# EAGLE design pcb3 (EAGLE 9.7.0)
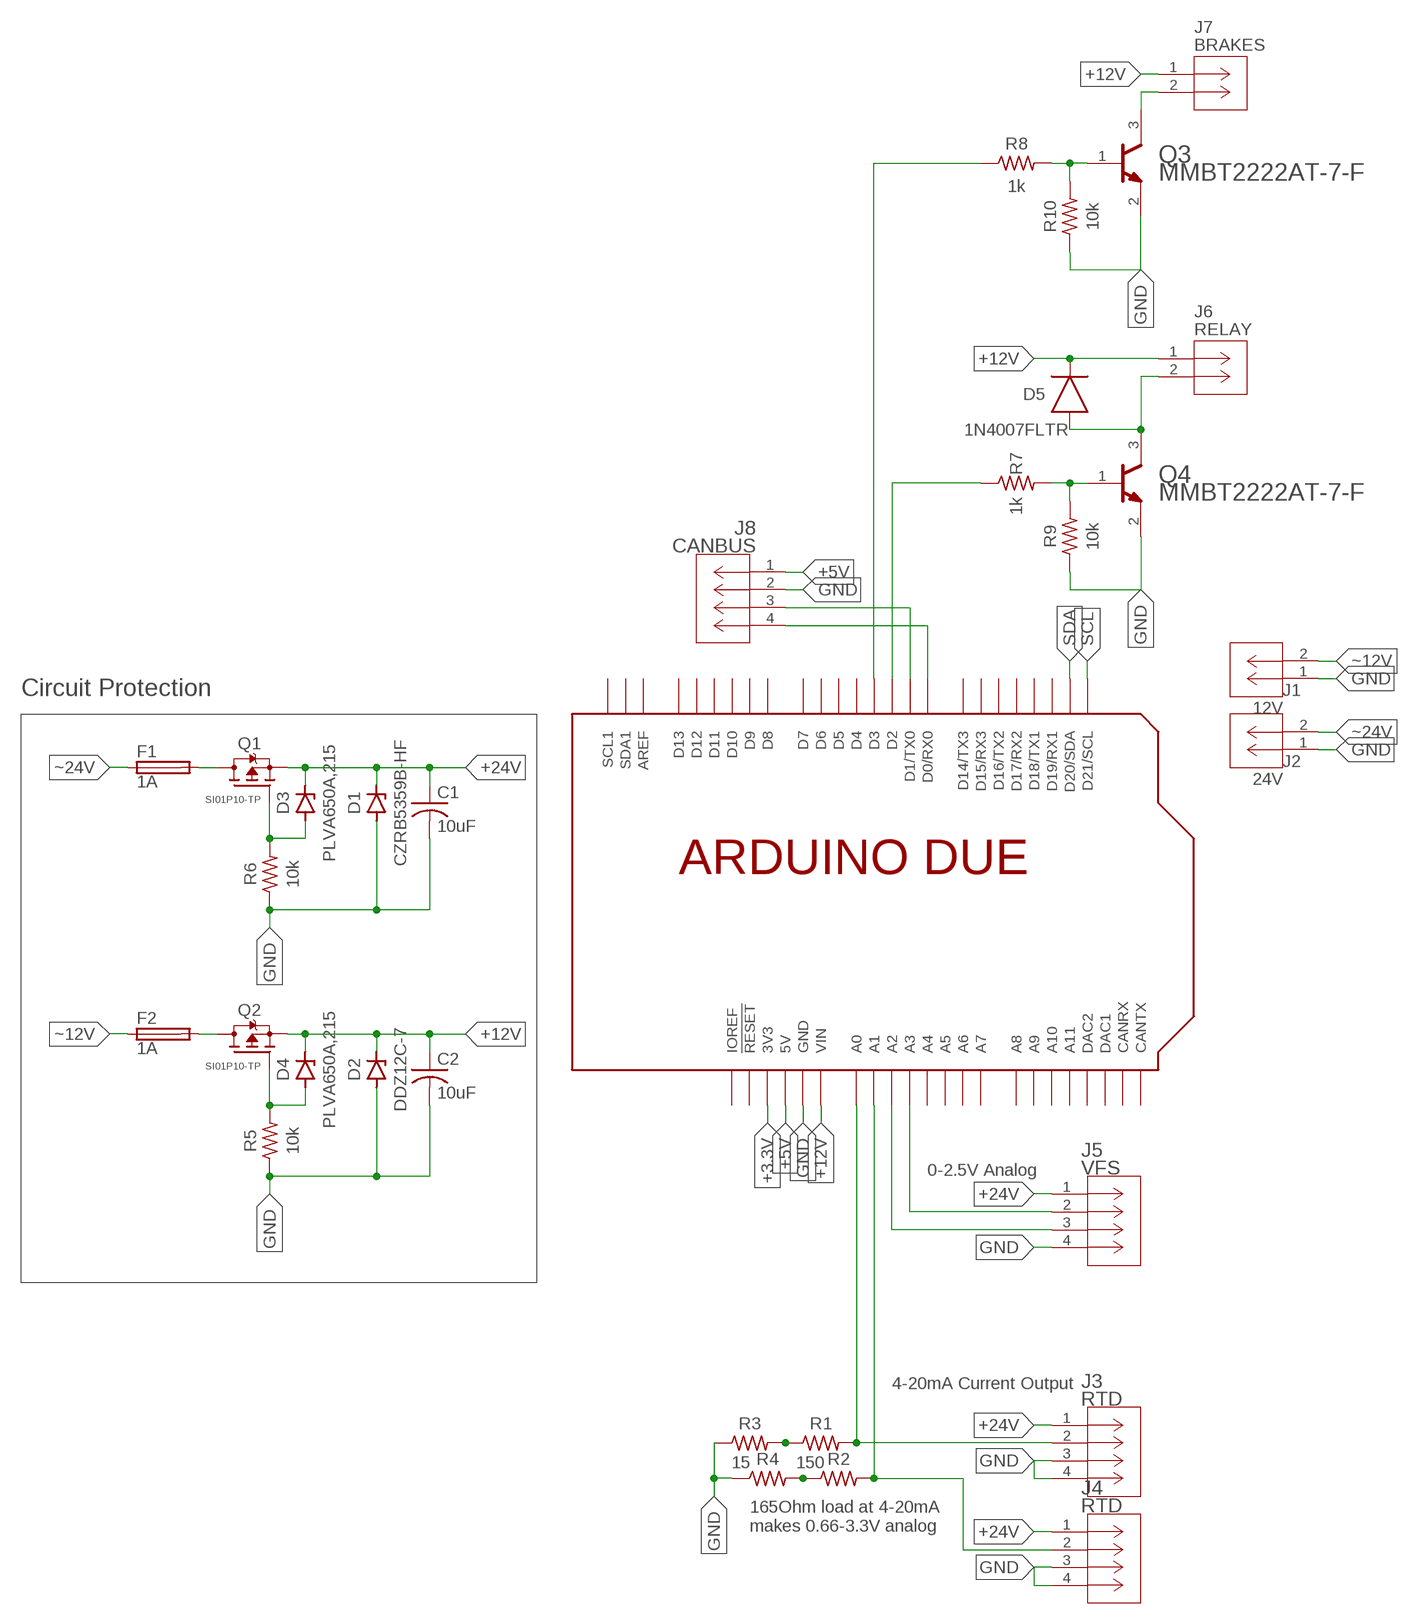
[diagram p0: schematic, sheet 1]

## Parts
C1  10uF  C-US_CHIP-1206(3216-METRIC)  [CAPC3216X135]
C2  10uF  C-US_CHIP-1206(3216-METRIC)  [CAPC3216X135]
D1  CZRB5359B-HF  ZENER_SMBJ5339BDO-214AA(SMB)  [DIOM5336X265N]
D2  DDZ12C-7  ZENER_MMSZ5240BTDO-219-AB(SOD123F)  [SODFL3718X115]
D3  PLVA650A,215  ZENER_SOT23  [SOT23]
D4  PLVA650A,215  ZENER_SOT23  [SOT23]
D5  1N4007FLTR  DIODE_SOD-123F  [SOD-123F]
F1  1A  FUSE_CHIP-0603(1608-METRIC)  [FUSC1608X60N]
F2  1A  FUSE_CHIP-0603(1608-METRIC)  [FUSC1608X60N]
J1  12V  5055670271CON_5055670271  [CON_5055670271]
J2  24V  5055670271CON_5055670271  [CON_5055670271]
J3  RTD  MICROLOCK-4PIN  [4PIN]
J4  RTD  MICROLOCK-4PIN  [4PIN]
J5  VFS  MICROLOCK-4PIN  [4PIN]
J6  RELAY  MICROLOCK-2PINCON_5055670271  [2PIN]
J7  BRAKES  MICROLOCK-2PINCON_5055670271  [2PIN]
J8  CANBUS  MICROLOCK-4PIN  [4PIN]
Q1  SI01P10-TP  PMOSFET_SOT23  [SOT23]
Q2  SI01P10-TP  PMOSFET_SOT23  [SOT23]
Q3  MMBT2222AT-7-F  NPN_SOT-523DIODES_INC_MMBT2222AT-7-F_0_0  [SOT-523]
Q4  MMBT2222AT-7-F  NPN_SOT-523DIODES_INC_MMBT2222AT-7-F_0_0  [SOT-523]
R1  150  R-US_CHIP-0603(1608-METRIC)  [RESC1608X60]
R2  150  R-US_CHIP-0603(1608-METRIC)  [RESC1608X60]
R3  15  R-US_CHIP-0603(1608-METRIC)  [RESC1608X60]
R4  15  R-US_CHIP-0603(1608-METRIC)  [RESC1608X60]
R5  10k  R-US_CHIP-0603(1608-METRIC)  [RESC1608X60]
R6  10k  R-US_CHIP-0603(1608-METRIC)  [RESC1608X60]
R7  1k  R-US_CHIP-0603(1608-METRIC)  [RESC1608X60]
R8  1k  R-US_CHIP-0603(1608-METRIC)  [RESC1608X60]
R9  10k  R-US_CHIP-0603(1608-METRIC)  [RESC1608X60]
R10  10k  R-US_CHIP-0603(1608-METRIC)  [RESC1608X60]
U$1  ARDUINODUE_MIN_NOHOLES  [ARDUINODUE_MIN_NOHOLES]

## Nets
+3.3V: U$1.3V3
+5V: J8.1 U$1.5V
+12V: C2.1 D2.1(C) D4.3(C) D5.C J6.1 J7.1 Q2.2(S) U$1.VIN
+24V: C1.1 D1.1(C) D3.3(C) J3.1 J4.1 J5.1 Q1.2(S)
GND: C1.2 C2.2 D1.2(A) D2.2(A) J1.1 J2.1 J3.3 J3.4 J4.3 J4.4 J5.4 J8.2 Q3.2(E) Q4.2(E) R3.1 R4.1 R5.1 R6.1 R9.1 R10.1 U$1.GND U$1.GND1(GND) U$1.GND2(GND)
N$1: J3.2 R1.2 U$1.A0
N$2: J4.2 R2.2 U$1.A1
N$3: J5.2 U$1.A3
N$4: J5.3 U$1.A2
N$5: J7.2 Q3.3(C)
N$6: R8.1 U$1.D3
N$7: D5.A J6.2 Q4.3(C)
N$8: R1.1 R3.2
N$9: D3.1(A) Q1.1(G) R6.2
N$10: R2.1 R4.2
N$11: D4.1(A) Q2.1(G) R5.2
N$12: F2.2 Q2.3(D)
N$13: F1.2 Q1.3(D)
N$14: R7.1 U$1.D2
N$15: Q4.1(B) R7.2 R9.2
N$16: Q3.1(B) R8.2 R10.2
N$19: J8.3 U$1.D1(D1/TX0)
N$20: J8.4 U$1.D0(D0/RX0)
SCL: U$1.D21(D21/SCL)
SDA: U$1.D20(D20/SDA)
~12V: F2.1 J1.2
~24V: F1.1 J2.2
Unconnected: U$1.A4 U$1.A5 U$1.A6 U$1.A7 U$1.A8 U$1.A9 U$1.A10 U$1.A11 U$1.AREF U$1.CANRX U$1.CANTX U$1.D4 U$1.D5 U$1.D6 U$1.D7 U$1.D8 U$1.D9 U$1.D10 U$1.D11 U$1.D12 U$1.D13 U$1.D14(D14/TX3) U$1.D15(D15/RX3) U$1.D16(D16/TX2) U$1.D17(D17/RX2) U$1.D18(D18/TX1) U$1.D19(D19/RX1) U$1.DAC1 U$1.DAC2 U$1.IOREF U$1.RESET(!RESET) U$1.SCL1 U$1.SDA1

## Notes on the sheet
- Circuit Protection
- 0-2.5V Analog
- 4-20mA Current Output
- 165Ohm load at 4-20mA 
  makes 0.66-3.3V analog

## Library data of the parts
C1 C2 = Capacitor:C-US: Capacitor - ANSI; CATEGORY: Capacitor
D1 = Diode:ZENER_: Zener Diode - Popular parts; CATEGORY: Diode; DESCRIPTION: DIODE ZENER 5.6V 5W DO214AA; MANUFACTURER: Micro Commercial Co; MPN: SMBJ5339B-TP; SUB-CATEGORY: Zener; THERMALLOSS: 5W; VALUE: SMBJ5339B
D2 = Diode:ZENER_: Zener Diode - Popular parts; CATEGORY: Diode; DESCRIPTION: DIODE ZENER 10V 500MW SOD123; MANUFACTURER: ON Semiconductor; MPN: MMSZ5240BT1G; SUB-CATEGORY: Zener; THERMALLOSS: 0.5W; VALUE: MMSZ5240BT1G
D3 D4 = Zener SOT23:ZENER_SOT23
D5 = Diode SOT-123FL:DIODE_SOD-123F
F1 F2 = Circuit-Protection:FUSE: Fuse - Generic; CATEGORY: Circuit-Protection; SUB-CATEGORY: Fuse
J1 J2 = Molex Micro-Lock PLUS (2-pin):5055670271; COPYRIGHT: Copyright (C) 2022 Ultra Librarian. All rights reserved.; MANUFACTURER_PART_NUMBER: 5055670271; MFR_NAME: Molex Connector Corporation
J3-J5 J8 = Molex Micro-Lock PLUS:MICROLOCK-4PIN
J6 J7 = Molex Micro-Lock PLUS:MICROLOCK-2PIN; COPYRIGHT: Copyright (C) 2022 Ultra Librarian. All rights reserved.; MANUFACTURER_PART_NUMBER: 5055670271; MFR_NAME: Molex Connector Corporation
Q1 Q2 = MOSFET SOT23:PMOSFET_SOT23
Q3 Q4 = NPN SOT-523:NPN_SOT-523: Bipolar (BJT) Transistor NPN 40V 600mA 300MHz 150mW Surface Mount SOT-523; AUTOMOTIVE: Yes; AUTOMOTIVE_GRADE: Grade 0; CENTROID_NOT_SPECIFIED: No; COLLECTOR_BASE_VOLTAGE: 75V; COLLECTOR_EMITTER_BREAKDOWN_VOLTAGE: 40V; COLLECTOR_EMITTER_SATURATION_VOLTAGE: 0.3V; COLLECTOR_EMITTER_VOLTAGE: 40V; DATASHEET: https://www.diodes.com/assets/Datasheets/ds30268.pdf; DELAY_TIME_TD: 10ns; DEVICE_CLASS_L1: Discrete Semiconductors; DEVICE_CLASS_L2: Transistors; DEVICE_CLASS_L3: BJTs; DIGIKEY_DESCRIPTION: TRANS NPN 40V 0.6A SOT523; DIGIKEY_PART_NUMBER: MMBT2222AT-FDICT-ND; EMITTER_BASE_VOLTAGE: 6V; FALL_TIME_TF: 60ns; FOOTPRINT_PARAMETERS_1: {"fp_type":"SOT523","params":{"N":{"long name":"Number of leads","type":"fixed","short name":"N","value":3},"A":{"nom":800000,"long name":"Height","min":600000,"max":900000,"short name":"A","type":"measurement"},"A1":{"nom":50000,"long name":"Standoff height","min":0,"max":100000,"short name":"A1","type":"measurement"},"A2":{"nom":750000,"long name":"Package height","min":600000,"max":800000,"short name":"A2","type":"measurement"},"E":{"nom":1600000,"long name":"Width /w leads","min":1450000,"max":1750000,"short name":"E","type":"measurement"},"E1":{"nom":800000,"long name":"Package width","min":750000,"max":850000,"short name":"E1","type":"measurement"},"D":{"nom":1600000,"long name":"Package length","min":1500000,"max":1700000,"short name":"D","type":"measurement"},"B":{"nom":220000,"long name":"Lead width","min":150000,"max":300000,"short name":"B","type":"measurement"},"B2":{"nom":220000,"long name":"Thermal lead width","min":150000,"max":300000,"short name":"B2","type":"measurement"},"C":{"nom":120000,"long name":"Lead thickness","min":100000,"max":200000,"short name":"C","type":"measurement"},"L":{"nom":330000,"long name":"Lead foot length","min":200000,"max":400000,"short name":"L","type":"measurement"},"e":{"nom":500000,"long name":"Lead pitch","min":null,"max":null,"short name":"e","type":"measurement"},"PHI":{"nom":8000000,"long name":"Lead angle","min":0,"max":false,"short name":"PHI","type":"measurement"},"offset x":{"nom":0,"long name":"X Center offset","min":null,"max":null,"short name":"offset x","type":"measurement"},"offset y":{"nom":0,"long name":"Y Center offset","min":null,"max":null,"short name":"offset y","type":"measurement"},"LS":{"default":"Rounded rectangle","long name":"Land shape","type":"multichoice","short name":"LS"},"LS1":{"default":"Rectangle","long name":"Land shape (Pin 1)","type":"multichoice","short name":"LS1"},"solder toe":{"nom":550000,"long name":"Solder fillet (toe)","min":null,"max":null,"short name":"solder toe","type":"fixedmeasurement"},"solder heel":{"nom":450000,"long name":"Solder fillet (heel)","min":null,"max":null,"short name":"solder heel","type":"fixedmeasurement"},"solder side":{"nom":50000,"long name":"Solder fillet (side)","min":null,"max":null,"short name":"solder side","type":"fixedmeasurement"},"courtyard":{"nom":500000,"long name":"Courtyard","min":null,"max":null,"short name":"courtyard","type":"fixedmeasurement"},"SF":{"default":"A","long name":"Packing level","type":"multichoiceparent","short name":"SF","help":"http://support.upverter.com/customer/portal/articles/978783-what-is-a-footprint-packing-level","children":["solder toe","solder heel","solder side","courtyard"]}}}; FOOTPRINT_PARAMETERS_2: {"fp_type":"SOT523","params":{"N":{"long name":"Number of leads","type":"fixed","short name":"N","value":3},"A":{"nom":800000,"long name":"Height","min":600000,"max":900000,"short name":"A","type":"measurement"},"A1":{"nom":50000,"long name":"Standoff height","min":0,"max":100000,"short name":"A1","type":"measurement"},"A2":{"nom":750000,"long name":"Package height","min":600000,"max":800000,"short name":"A2","type":"measurement"},"E":{"nom":1600000,"long name":"Width /w leads","min":1450000,"max":1750000,"short name":"E","type":"measurement"},"E1":{"nom":800000,"long name":"Package width","min":750000,"max":850000,"short name":"E1","type":"measurement"},"D":{"nom":1600000,"long name":"Package length","min":1500000,"max":1700000,"short name":"D","type":"measurement"},"B":{"nom":220000,"long name":"Lead width","min":150000,"max":300000,"short name":"B","type":"measurement"},"B2":{"nom":220000,"long name":"Thermal lead width","min":150000,"max":300000,"short name":"B2","type":"measurement"},"C":{"nom":120000,"long name":"Lead thickness","min":100000,"max":200000,"short name":"C","type":"measurement"},"L":{"nom":330000,"long name":"Lead foot length","min":200000,"max":400000,"short name":"L","type":"measurement"},"e":{"nom":500000,"long name":"Lead pitch","min":null,"max":null,"short name":"e","type":"measurement"},"PHI":{"nom":8000000,"long name":"Lead angle","min":0,"max":false,"short name":"PHI","type":"measurement"},"offset x":{"nom":0,"long name":"X Center offset","min":null,"max":null,"short name":"offset x","type":"measurement"},"offset y":{"nom":0,"long name":"Y Center offset","min":null,"max":null,"short name":"offset y","type":"measurement"},"LS":{"default":"Rounded rectangle","long name":"Land shape","type":"multichoice","short name":"LS"},"LS1":{"default":"Rectangle","long name":"Land shape (Pin 1)","type":"multichoice","short name":"LS1"},"solder toe":{"nom":350000,"long name":"Solder fillet (toe)","min":null,"max":null,"short name":"solder toe","type":"fixedmeasurement"},"solder heel":{"nom":350000,"long name":"Solder fillet (heel)","min":null,"max":null,"short name":"solder heel","type":"fixedmeasurement"},"solder side":{"nom":30000,"long name":"Solder fillet (side)","min":null,"max":null,"short name":"solder side","type":"fixedmeasurement"},"courtyard":{"nom":250000,"long name":"Courtyard","min":null,"max":null,"short name":"courtyard","type":"fixedmeasurement"},"SF":{"default":"B","long name":"Packing level","type":"multichoiceparent","short name":"SF","help":"http://support.upverter.com/customer/portal/articles/978783-what-is-a-footprint-packing-level","children":["solder toe","solder heel","solder side","courtyard"]}}}; FOOTPRINT_PARAMETERS_3: {"fp_type":"SOT523","params":{"N":{"long name":"Number of leads","type":"fixed","short name":"N","value":3},"A":{"nom":800000,"long name":"Height","min":600000,"max":900000,"short name":"A","type":"measurement"},"A1":{"nom":50000,"long name":"Standoff height","min":0,"max":100000,"short name":"A1","type":"measurement"},"A2":{"nom":750000,"long name":"Package height","min":600000,"max":800000,"short name":"A2","type":"measurement"},"E":{"nom":1600000,"long name":"Width /w leads","min":1450000,"max":1750000,"short name":"E","type":"measurement"},"E1":{"nom":800000,"long name":"Package width","min":750000,"max":850000,"short name":"E1","type":"measurement"},"D":{"nom":1600000,"long name":"Package length","min":1500000,"max":1700000,"short name":"D","type":"measurement"},"B":{"nom":220000,"long name":"Lead width","min":150000,"max":300000,"short name":"B","type":"measurement"},"B2":{"nom":220000,"long name":"Thermal lead width","min":150000,"max":300000,"short name":"B2","type":"measurement"},"C":{"nom":120000,"long name":"Lead thickness","min":100000,"max":200000,"short name":"C","type":"measurement"},"L":{"nom":330000,"long name":"Lead foot length","min":200000,"max":400000,"short name":"L","type":"measurement"},"e":{"nom":500000,"long name":"Lead pitch","min":null,"max":null,"short name":"e","type":"measurement"},"PHI":{"nom":8000000,"long name":"Lead angle","min":0,"max":false,"short name":"PHI","type":"measurement"},"offset x":{"nom":0,"long name":"X Center offset","min":null,"max":null,"short name":"offset x","type":"measurement"},"offset y":{"nom":0,"long name":"Y Center offset","min":null,"max":null,"short name":"offset y","type":"measurement"},"LS":{"default":"Rounded rectangle","long name":"Land shape","type":"multichoice","short name":"LS"},"LS1":{"default":"Rectangle","long name":"Land shape (Pin 1)","type":"multichoice","short name":"LS1"},"solder toe":{"nom":150000,"long name":"Solder fillet (toe)","min":null,"max":null,"short name":"solder toe","type":"fixedmeasurement"},"solder heel":{"nom":250000,"long name":"Solder fillet (heel)","min":null,"max":null,"short name":"solder heel","type":"fixedmeasurement"},"solder side":{"nom":10000,"long name":"Solder fillet (side)","min":null,"max":null,"short name":"solder side","type":"fixedmeasurement"},"courtyard":{"nom":100000,"long name":"Courtyard","min":null,"max":null,"short name":"courtyard","type":"fixedmeasurement"},"SF":{"default":"C","long name":"Packing level","type":"multichoiceparent","short name":"SF","help":"http://support.upverter.com/customer/portal/articles/978783-what-is-a-footprint-packing-level","children":["solder toe","solder heel","solder side","courtyard"]}}}; FOOTPRINT_URL: https://www.diodes.com/assets/Package-Files/SOT523.pdf; FOOTPRINT_VARIANT_NAME_0: Recommended_Land_Pattern; FOOTPRINT_VARIANT_NAME_1: IPC_A; FOOTPRINT_VARIANT_NAME_2: IPC_B; FOOTPRINT_VARIANT_NAME_3: IPC_C; GAIN_BANDWIDTH_PRODUCT: 300MHz; HEIGHT: 0.9mm; HFE_MAX: 300; HFE_MIN: 100; HFE_SS_MAX: 375; HFE_SS_MIN: 75; HFE_SS_TESTIC: 10mA; HFE_SS_TESTVCE: 10V; HFE_TESTIC: 150mA; HFE_TESTVCE: 10V; LEAD_FREE: Yes; MAX_COLLECTOR_CURRENT: 600mA; MAX_JUNCTION_TEMP: +150°C; MF: Diodes Inc; MFG_PACKAGE_IDENT: SOT523; MFG_PACKAGE_IDENT_COMPONENT_ID: b0b698c33057526b; MFG_PACKAGE_IDENT_DATE: 04/2018; MFG_PACKAGE_IDENT_REV: 0; MOUSER_DESCRIPTION: Bipolar Transistors - BJT 40V 150mW; MOUSER_PART_NUMBER: 621-MMBT2222AT-F; MPN: MMBT2222AT-7-F; NUMBER_OF_ELEMENTS: 1; NUMBER_OF_NPN: 1; PACKAGE: SOT-523; POWER_DISSIPATION: 150mW; PREFIX: Q; RISE_TIME_TR: 25ns; ROHS: Yes; RTHJA_MAX: 833°C/W; STANDOFF_HEIGHT: 0mm; STORAGE_TIME_TS: 225ns; TEMPERATURE_RANGE_HIGH: +150°C; TEMPERATURE_RANGE_LOW: -55°C; UNITY_GAIN_FREQ: 300MHz; VERIFICATION_VERSION: 0.0.0.3
R1-R10 = Resistor:R-US: Resistor Fixed - ANSI; CATEGORY: Resistor; SUB-CATEGORY: Fixed
U$1 = Arduino Shields:ARDUINODUE_MIN_NOHOLES

## Board
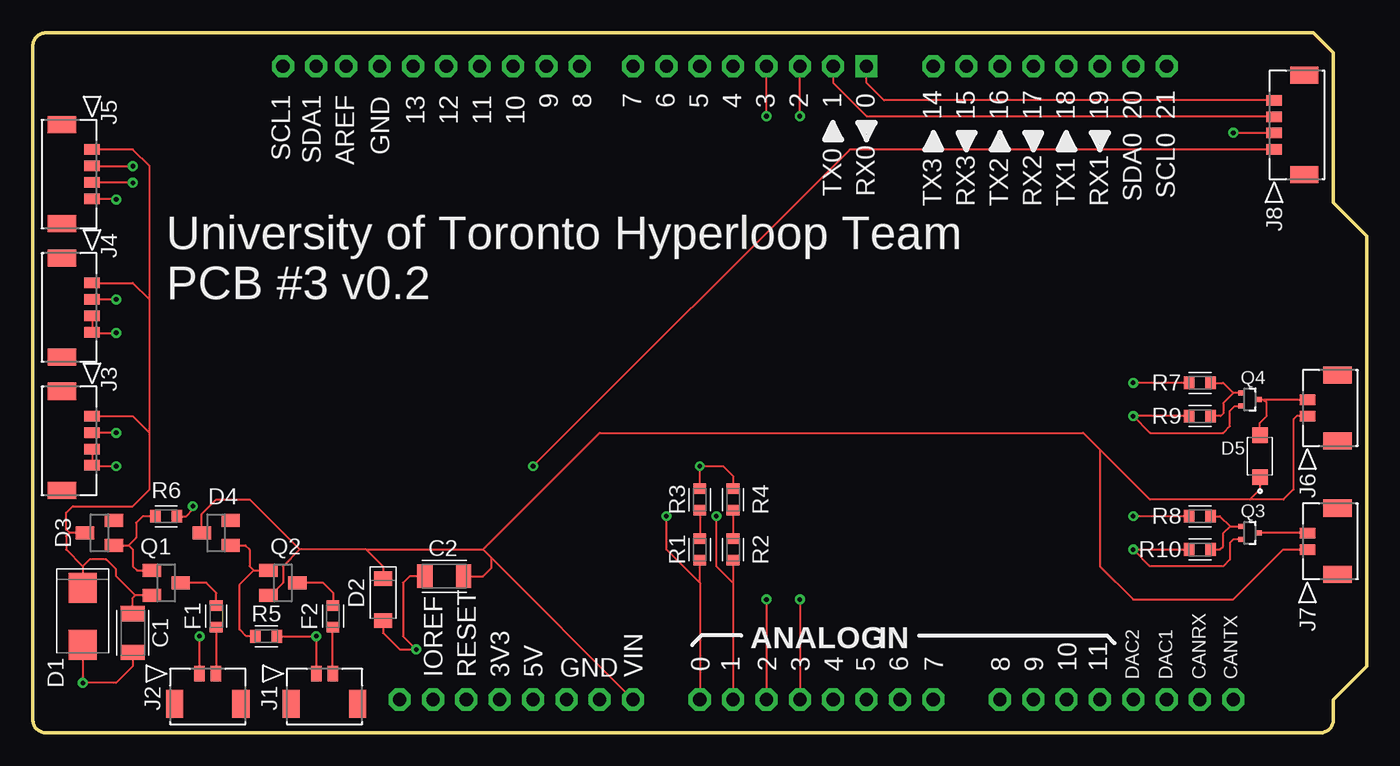
[diagram p1: board, top side]
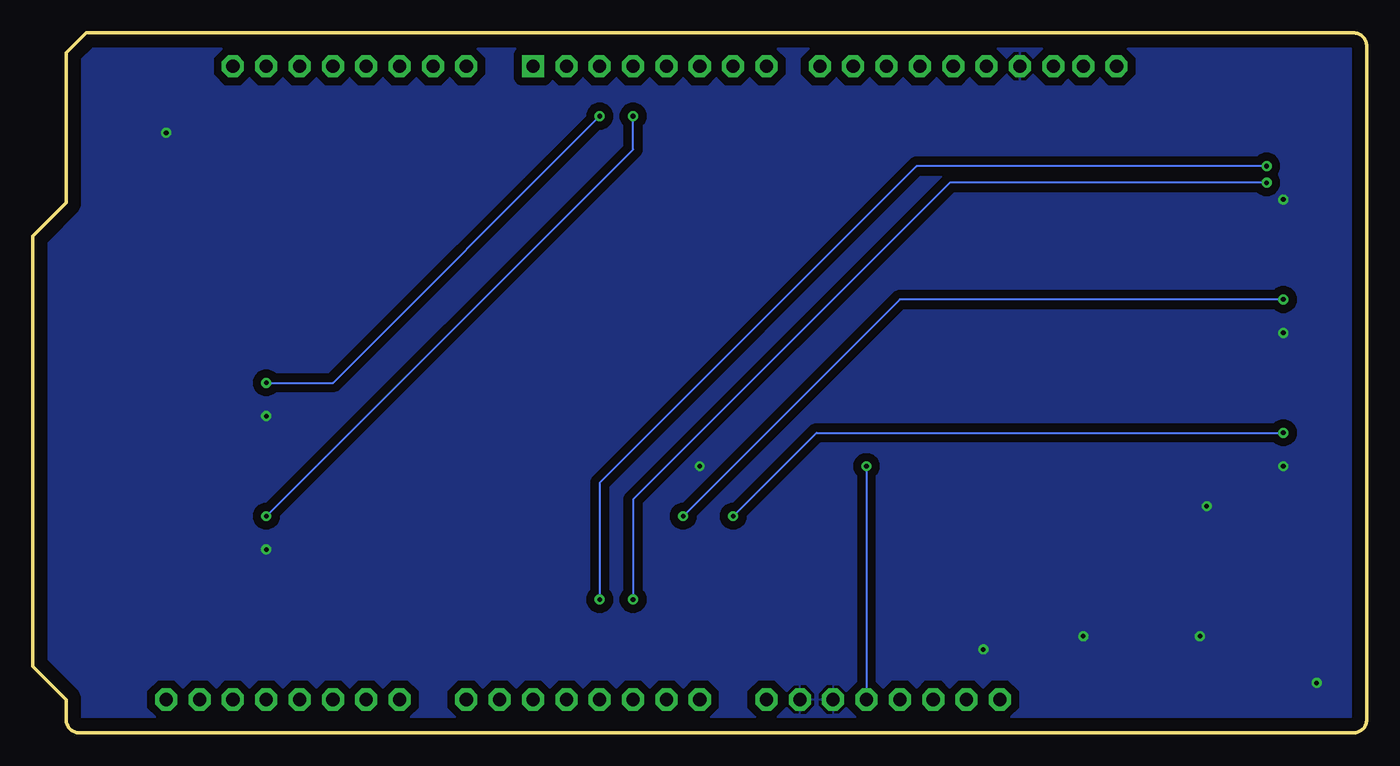
[diagram p2: board, bottom side, seen from below]

Size 101.6 x 53.34 mm. Coordinates in mm from the lower left corner, seen from the top.
Copper layers (1*16): Top 0.035mm / dielectric 1.5mm / Bottom 0.035mm
Design rules "default": minimum track width 6mil, minimum drill 0.35mm, track to track 6mil, track to pad 6mil, pad to pad 6mil, via to via 6mil, smd to smd 6mil, copper to edge 40mil, drill to drill 6mil, minimum pad ring 10mil, minimum via ring 8mil, stop-mask expansion 4mil, vias tented up to drill 0mil, thermal gap 10mil

### Footprints (pad centres in the part's own frame; a part is rotated, then mirrored left to right if it is on the bottom)
CAPC3216X135 = smd 1.165 x 1.815: 1 -1.475,0; 2 1.475,0
DIOM5336X265N = smd 2.284 x 2.124: 1 -2.164,0; 2 2.164,0
SODFL3718X115 = smd 1.115 x 1.361: 1 -1.6,0; 2 1.6,0
SOT23 = smd 1 x 1.4: 1 -0.95,-1.1; 2 0.95,-1.1; 3 0,1.1
SOD-123F = smd 1.18 x 1.17: A 1.59,0; C -1.59,0
FUSC1608X60N = smd 0.799 x 0.974: 1 -0.815,0; 2 0.815,0
CON_5055670271 = smd 0.8 x 1.2: 1 0,0; 2 -1.25,0 | smd 1.3 x 2.15: 3 1.9,2.295; 4 -3.15,2.295
4PIN = smd 0.8 x 1.2: 1 0,0; 2 -1.25,0; 3 -2.5,0; 4 -3.75,0 | smd 1.3 x 2.15: 5 1.9,2.295; 6 -5.65,2.295
2PIN = smd 0.8 x 1.2: 1 0,0; 2 -1.25,0 | smd 1.3 x 2.15: 3 1.9,2.295; 4 -3.15,2.295
SOT-523 = smd 0.51 x 0.4: 1 -0.645,0.5; 2 -0.645,-0.5; 3 0.645,0
RESC1608X60 = smd 0.799 x 0.974: 1 -0.815,0; 2 0.815,0
ARDUINODUE_MIN_NOHOLES = drill 1 pad 1.676 octagon: 3V3 35.56,2.54; 5V 38.1,2.54; A0 50.8,2.54; A1 53.34,2.54; A2 55.88,2.54; A3 58.42,2.54; A4 60.96,2.54; A5 63.5,2.54; A6 66.04,2.54; A7 68.58,2.54; A8 73.66,2.54; A9 76.2,2.54; A10 78.74,2.54; A11 81.28,2.54; AREF 23.876,50.8; CANRX 88.9,2.54; CANTX 91.44,2.54; D1 60.96,50.8; D2 58.42,50.8; D3 55.88,50.8; D4 53.34,50.8; D5 50.8,50.8; D6 48.26,50.8; D7 45.72,50.8; D8 41.656,50.8; D9 39.116,50.8; D10 36.576,50.8; D11 34.036,50.8; D12 31.496,50.8; D13 28.956,50.8; D14 68.58,50.8; D15 71.12,50.8; D16 73.66,50.8; D17 76.2,50.8; D18 78.74,50.8; D19 81.28,50.8; D20 83.82,50.8; D21 86.36,50.8; DAC1 86.36,2.54; DAC2 83.82,2.54; GND 26.416,50.8; GND1 43.18,2.54; GND2 40.64,2.54; IOREF 30.48,2.54; NC 27.94,2.54; RESET 33.02,2.54; SCL1 19.05,50.8; SDA1 21.59,50.8; VIN 45.72,2.54 | drill 1 pad 1.676 square: D0 63.5,50.8

### Placement (x,y rotation side)
C1  7.62,7.62 270 top
C2  31.34,11.94 180 top
D1  3.81,8.89 270 top
D2  26.67,10.16 270 top
D3  5.08,15.24 90 top
D4  13.97,15.24 90 top
D5  93.47,21.08 90 top
F1  13.97,8.89 90 top
F2  22.86,8.89 90 top
J1  21.59,4.51 180 top
J2  12.7,4.51 180 top
J3  4.51,24.13 90 top
J4  4.51,34.29 90 top
J5  4.51,44.45 90 top
J6  97.09,24.13 270 top
J7  97.09,13.97 270 top
J8  94.55,44.45 270 top
Q1  10.16,11.43 270 top
Q2  19.05,11.43 270 top
Q3  92.71,15.24 0 top
Q4  92.71,25.4 0 top
R1  50.8,13.97 270 top
R2  53.34,13.97 270 top
R3  50.8,17.78 270 top
R4  53.34,17.78 270 top
R5  17.78,7.37 180 top
R6  10.16,16.51 180 top
R7  88.9,26.67 0 top
R8  88.9,16.51 0 top
R9  88.9,24.13 0 top
R10  88.9,13.97 0 top
U$1  0,0 0 top

### Tracks (layer width: path | path; a pad name or v marks a point on that pad's centre or on a via)
+5V  (via drill 0.35)
  Top 0.152: J8.1 62.23,44.45 v38.1,20.32
  Bottom 0.152: v38.1,20.32 U$1.5V
+12V
  Top 0.152: Q2.2 18.1,10.48 19.05,11.43 19.05,12.7 20.32,13.97 | U$1.VIN 34.92,13.34 | 34.92,13.34 34.29,13.97 | 25.4,13.97 34.29,13.97 | 25.4,13.97 20.32,13.97 | D4.3 12.87,16.68 13.97,17.78 16.51,17.78 20.32,13.97 | D2.1 26.67,12.7 25.4,13.97 | 34.29,13.97 43.18,22.86 80.01,22.86 81.28,21.59 | 81.28,21.59 81.28,12.7 83.82,10.16 91.44,10.16 95.25,13.97 J7.1 | J6.1 96.27,24.13 96.01,23.88 96.01,18.54 95.25,17.78 92.71,17.78 | 92.71,17.78 85.09,17.78 81.28,21.59 | D5.C 93.47,18.54 92.71,17.78 | C2.1 34.29,11.94 34.92,12.57 34.92,13.34
+24V
  Top 0.152: D3.3 2.79,15.24 | 2.79,15.24 2.54,15.49 2.54,16.76 3.05,17.27 7.62,17.27 8.89,18.54 8.89,22.86 | 8.89,22.86 8.89,33.02 | 8.89,33.02 8.89,43.18 7.62,44.45 J5.1 | 2.79,15.24 2.54,14.99 2.54,13.97 3.81,12.7 | 3.81,12.7 D1.1 | Q1.2 7.81,10.48 | 7.81,10.48 6.35,11.94 6.35,12.45 5.59,13.21 4.32,13.21 3.81,12.7 | 7.81,10.48 7.62,10.29 C1.1 | J4.1 7.62,34.29 8.89,33.02 | J3.1 7.62,24.13 8.89,22.86
GND  (via drill 0.35)
  Top 0.152: J1.1 v21.59,7.37 R5.1 | J2.1 v12.7,7.37 | D1.2 v3.81,3.81 6.35,3.81 7.62,5.08 C1.2 | R6.1 11.68,16.51 12.19,17.02 v12.19,17.27 | D2.2 26.67,7.62 27.94,6.35 v29.21,6.35 28.19,7.37 28.19,11.43 28.7,11.94 C2.2 | R3.1 v50.8,20.32 52.58,20.32 53.34,19.56 R4.1 | J3.3 J3.4 4.57,20.32 v6.35,20.32 | J4.3 J4.4 4.57,30.48 v6.35,30.48 | J5.4 6.29,40.7 v6.35,40.64 | R9.1 v83.82,24.13 85.09,22.86 90.68,22.86 91.19,23.37 91.19,24.53 91.56,24.9 Q4.2 | Q3.2 91.44,14.73 91.19,14.48 91.19,13.21 90.68,12.7 85.09,12.7 v83.82,13.97 R10.1 | J8.2 91.46,45.7 v91.44,45.72
  pour Bottom (isolate 0.635): -1.27,54.61 102.87,54.61 102.87,-1.27 -1.27,-1.27
N$1  (via drill 0.35)
  Top 0.152: 50.8,11.43 R1.2 | 50.8,11.43 U$1.A0 | 50.8,11.43 48.26,13.97 v48.26,16.51 | v6.35,22.86 4.53,22.86 J3.2
  Bottom 0.152: v48.26,16.51 41.91,22.86 v6.35,22.86
N$2  (via drill 0.35)
  Top 0.152: R2.2 53.34,11.43 | 53.34,11.43 U$1.A1 | J4.2 6.33,33.04 v6.35,33.02 | v52.07,16.51 52.07,12.7 53.34,11.43
  Bottom 0.152: v6.35,33.02 35.56,33.02 v52.07,16.51
N$3  (via drill 0.35)
  Top 0.152: J5.2 7.6,43.2 v7.62,43.18 | v58.42,10.16 U$1.A3
  Bottom 0.152: v7.62,43.18 34.29,43.18 58.42,19.05 v58.42,10.16
N$4  (via drill 0.35)
  Top 0.152: v7.62,41.91 4.55,41.91 J5.3 | v55.88,10.16 U$1.A2
  Bottom 0.152: v7.62,41.91 31.75,41.91 55.88,17.78 v55.88,10.16
N$5
  Top 0.152: J7.2 93.38,15.22 Q3.3
N$6  (via drill 0.35)
  Top 0.152: v55.88,46.99 U$1.D3 | R8.1 v83.82,16.51
  Bottom 0.152: v83.82,16.51 55.88,44.45 v55.88,46.99
N$7
  Top 0.152: J6.2 93.73,25.38 | 93.73,25.38 93.38,25.38 Q4.3 | D5.A 93.47,23.62 93.98,24.13 93.98,25.13 93.73,25.38
N$8
  Top 0.152: R3.2 R1.1
N$9
  Top 0.152: D3.1 7.3,14.29 | 7.3,14.29 7.62,13.97 7.62,12.7 7.94,12.38 Q1.1 | R6.2 8.38,16.51 7.87,16 7.87,14.86 7.3,14.29
N$10
  Top 0.152: R4.2 R2.1
N$11
  Top 0.152: D4.1 16.19,14.29 16.51,13.97 16.51,12.7 16.83,12.38 | 16.83,12.38 Q2.1 | R5.2 16.26,7.37 15.75,7.87 15.75,11.3 16.83,12.38
N$12
  Top 0.152: F2.2 22.86,10.67 22.1,11.43 Q2.3
N$13
  Top 0.152: F1.2 13.97,10.67 13.21,11.43 Q1.3
N$14  (via drill 0.35)
  Top 0.152: v58.42,46.99 U$1.D2 | R7.1 v83.82,26.67
  Bottom 0.152: v83.82,26.67 78.74,26.67 v58.42,46.99
N$15
  Top 0.152: Q4.1 91.45,25.9 | R7.2 90.68,26.67 91.45,25.9 | 91.45,25.9 90.68,25.13 90.68,24.33 90.48,24.13 R9.2
N$16
  Top 0.152: R8.2 90.42,16.51 91.19,15.74 | 91.19,15.74 Q3.1 | R10.2 90.42,13.97 90.68,14.22 90.68,15.22 91.19,15.74
N$19
  Top 0.152: U$1.D1 60.96,49.53 63.5,46.99 94.51,46.99 J8.3
N$20
  Top 0.152: J8.4 64.83,48.2 63.5,49.53 U$1.D0
~12V
  Top 0.152: J1.2 22.84,8.05 F2.1
~24V
  Top 0.152: F1.1 13.97,4.53 J2.2

### Text on the board
tPlace: University of Toronto Hyperloop Team / PCB #3 v0.2